# Altium project FDRV_1.2.PrjPCB
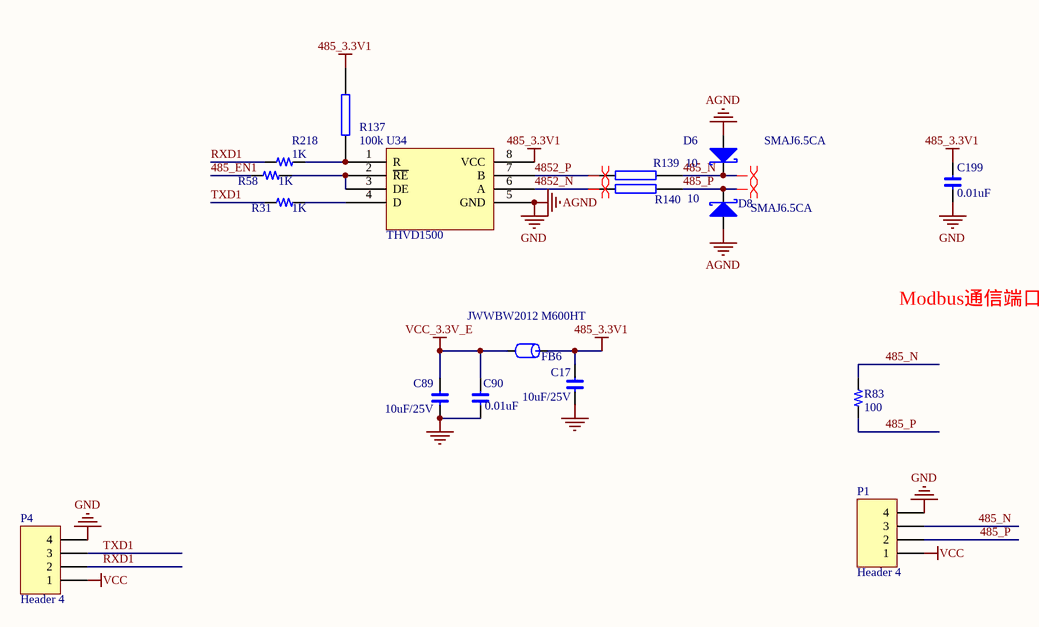
[diagram p0: RS485.SchDoc]
2 sheets, 59 parts. Net scope: global (net labels, ports and power ports of the same name join across sheets).
Board files: PCB1.PcbDoc, 尺子.PcbDoc
Sheets:
  RS485.SchDoc
  Sheet2.SchDoc

## Sheet RS485.SchDoc
size A4

### Parts
C17  10uF/25V  [0603C]
C89  10uF/25V  [0603C]
C90  0.01uF  [0603C]
C199  0.01uF  [0603C]
D6  SMAJ6.5CA  [SMA]
D8  SMAJ6.5CA  [SMA]
FB6  JWWBW2012 M600HT  [0805CZ]
P1  Header 4  [HDR1X4]
P4  Header 4  [HDR1X4]
R31  1K  [0603R]
R58  1K  [0603R]
R83  100  [0603R]
R137  100k  [0603R]
R139  10  [1206R]
R140  10  [1206R]
R218  1K  [0603R]
U34  THVD1500  [so-8]

### Nets
485_3.3V1: C17.2 C199.2 FB6.1 R137.2 U34.8(VCC)
AGND: C17.1 C89.1 C90.1 C199.1 D6.1(A) D8.1(A) P1.4 P4.4 U34.5(GND)  [also labelled GND]
VCC: P1.1 P4.1
VCC_3.3V_E: C89.2 C90.2 FB6.2
485_EN1: R58.2
485_N: D6.2(K) P1.3 R83.2 R139.1
485_P: D8.2(K) P1.2 R83.1 R140.1
4852_N: R140.2 U34.6(A)
4852_P: R139.2 U34.7(B)
RXD1: P4.2 R218.2
TXD1: P4.3 R31.2
NetR31_1: R31.1 U34.4(D)
NetR58_1: R58.1 U34.2(~{RE}) U34.3(DE)
NetR137_1: R137.1 R218.1 U34.1(R)

### Layout directives
differential pair: 485_N, 485_P, 4852_N, 4852_P

### Notes on the sheet
- Modbus通信端口

### Library data of the parts
C17 C89 C90 C199 = C
D6 D8 = DIODE S: Schottky Diode
FB6 = FB: Part Field 1: 磁珠/0603/1K ohm/100MHz; FB: BLM18BD102SN1(muRata); Text Field1: FB
P1 P4 = Header 4: Header, 4-Pin; LatestRevisionDate: 17-Jul-2002; LatestRevisionNote: Re-released for DXP Platform.; Publisher: Altium Limited
R31 R58 R83 R218 = R
R137 R139 R140 = RES2
U34 = SN65HVD06D

## Sheet Sheet2.SchDoc
size A3
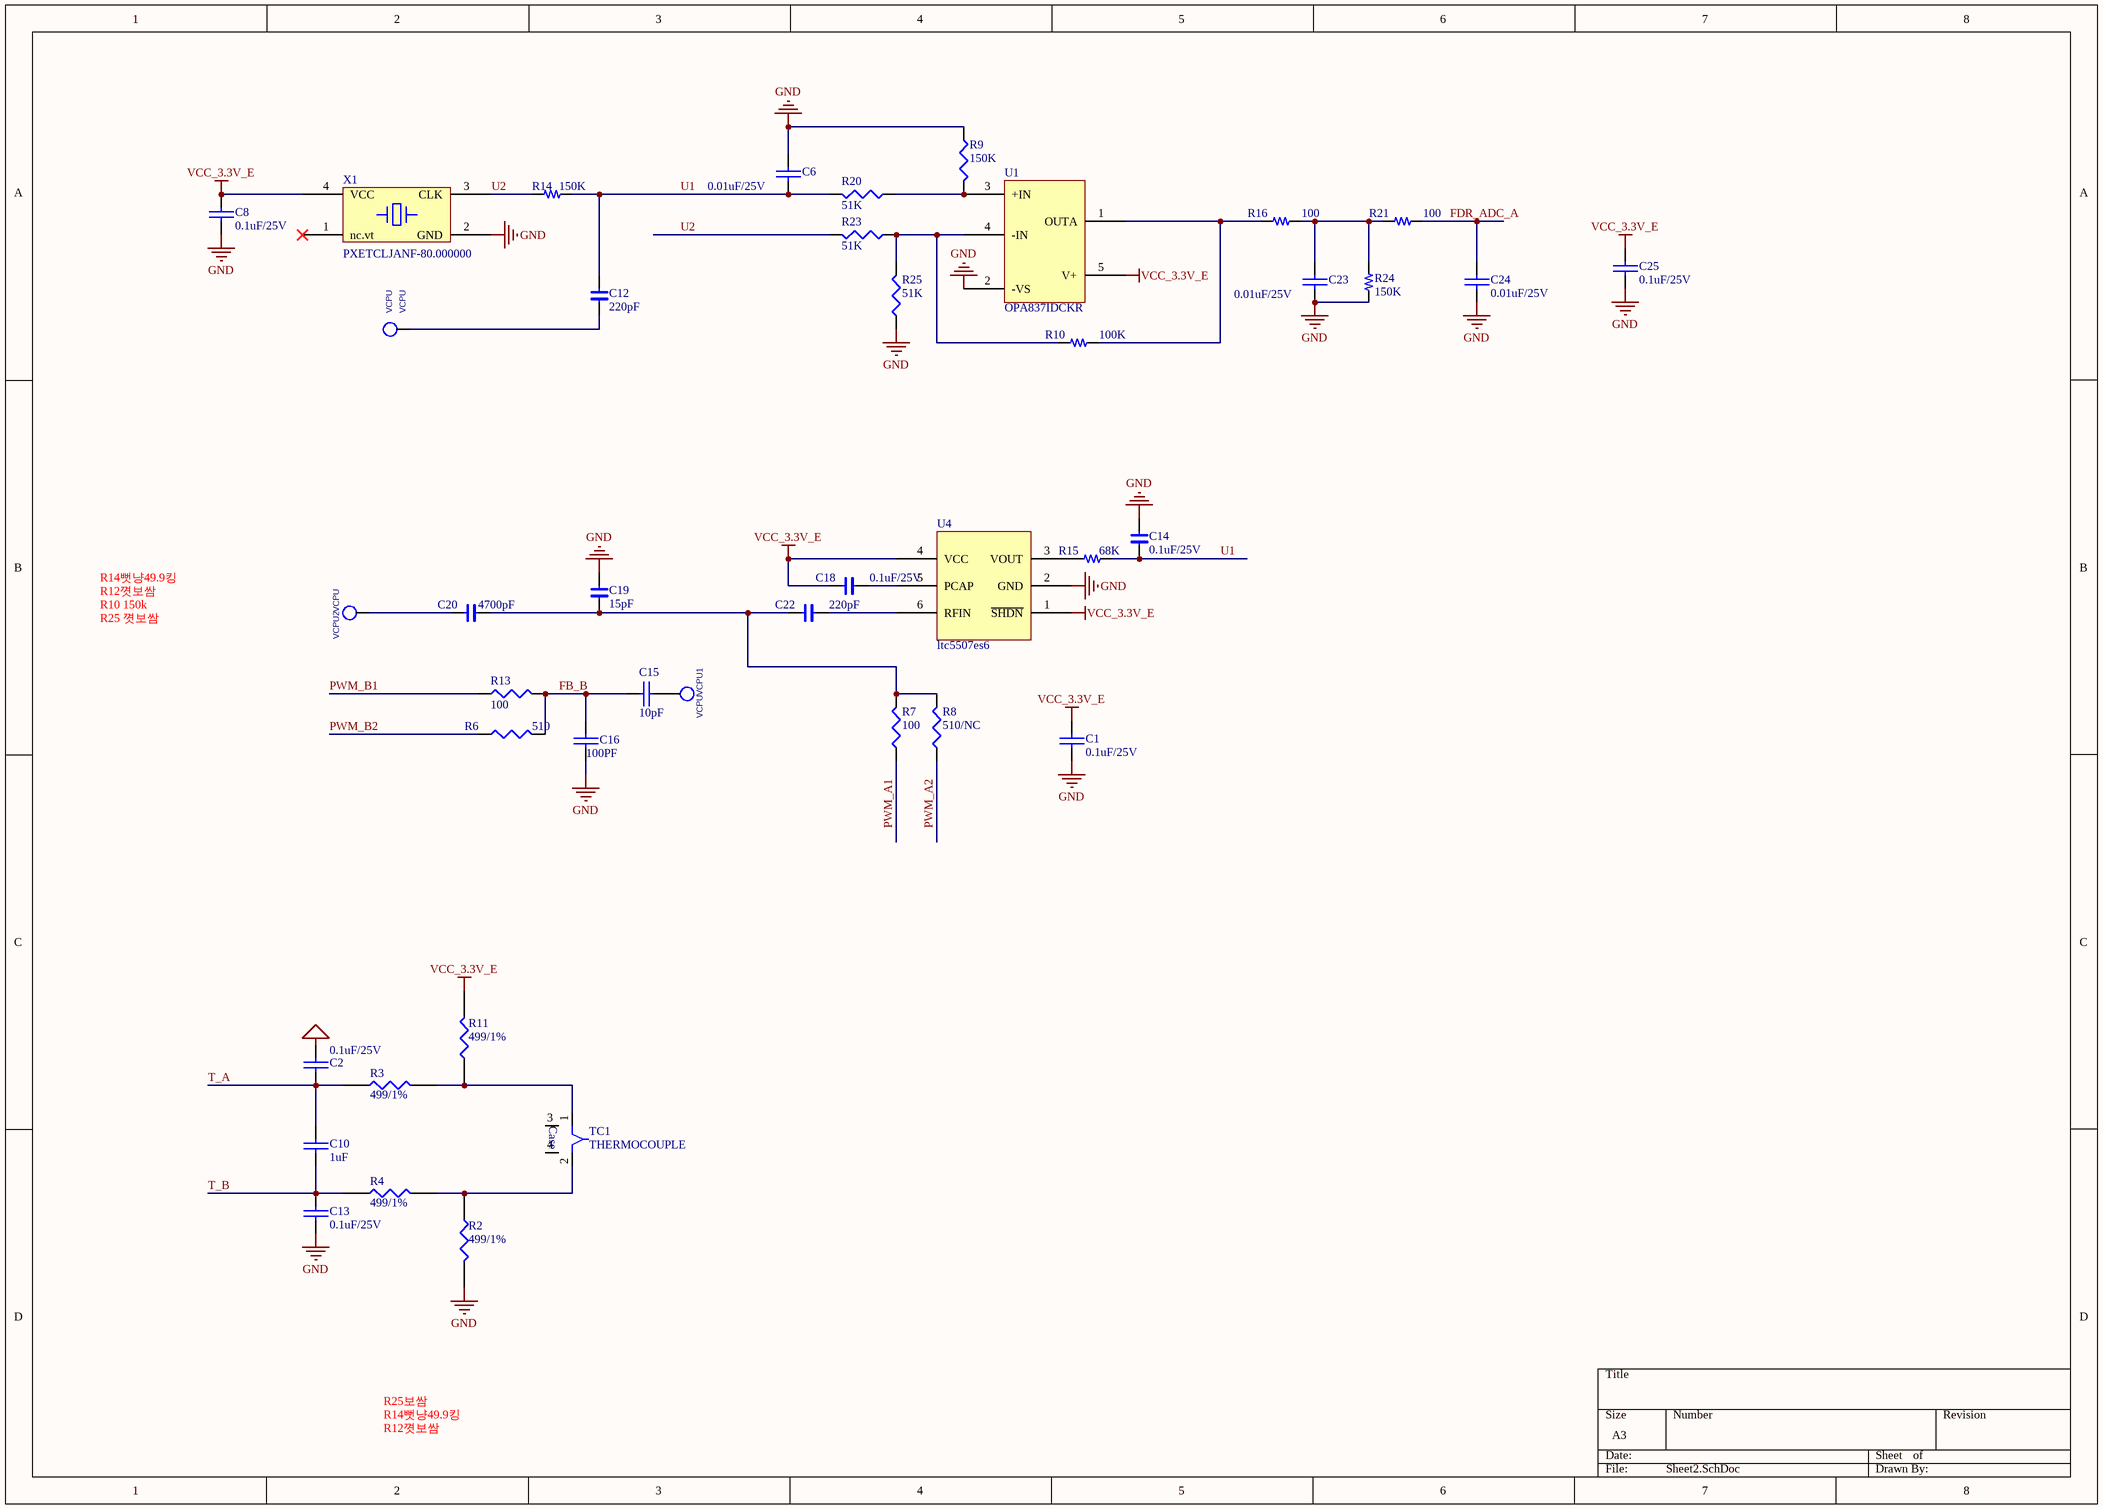
[diagram p1: Sheet2.SchDoc]

### Parts
C1  0.1uF/25V  [0603C]
C2  0.1uF/25V  [0603c]
C6  0.01uF/25V  [0603C]
C8  0.1uF/25V  [0603C]
C10  1uF  [0603c]
C12  220pF  [0603C]
C13  0.1uF/25V  [0603c]
C14  0.1uF/25V  [0603C]
C15  10pF  [0603C]
C16  100PF  [0603C]
C18  0.1uF/25V  [0603C]
C19  15pF  [0603C]
C20  4700pF  [0603C]
C22  220pF  [0603C]
C23  0.01uF/25V  [0603C]
C24  0.01uF/25V  [0603C]
C25  0.1uF/25V  [0603C]
R2  499/1%  [0603r]
R3  499/1%  [0603r]
R4  499/1%  [0603r]
R6  510  [0603R]
R7  100  [0603R]
R8  510/NC  [0603R]
R9  150K  [0603R]
R10  100K  [0603R]
R11  499/1%  [0603r]
R13  100  [0603R]
R14  150K  [0603r]
R15  68K  [0603r]
R16  100  [0603R]
R20  51K  [0603R]
R21  100  [0603R]
R23  51K  [0603R]
R24  150K  [0603R]
R25  51K  [0603R]
TC1  THERMOCOUPLE  [0603R]
U1  OPA837IDCKR  [SC70-5]
U4  ltc5507es6  [SOT23-6]
VCPU  VCPU  [probe]
VCPU1  VCPU  [probe]
VCPU2  VCPU  [probe]
X1  PXETCLJANF-80.000000  [XTAL4TN_7050]

### Nets
GND: C1.1 C2.2 C6.2 C8.2 C13.2 C14.2 C16.2 C19.2 C23.1 C24.1 C25.1 R2.2 R9.1 R24.1 R25.1 U1.2(-VS) U4.2(GND) X1.2(GND)  [project net AGND]
VCC_3.3V_E: C1.2 C8.1 C18.1 C25.2 R11.2 U1.5(V+) U4.1(~{SHDN}) U4.4(VCC) X1.4(VCC)
FB_B: C15.1 C16.1 R6.2 R13.2
FDR_ADC_A: C24.2 R21.2
PWM_A1: R7.1
PWM_A2: R8.1
PWM_B1: R13.1
PWM_B2: R6.1
T_A: C2.1 C10.1 R3.1
T_B: C10.2 C13.1 R4.1
U1: C6.1 C12.2 C14.1 R14.2 R15.1 R20.2
U2: R14.1 R23.2 X1.3(CLK)
NetC12_1: C12.1 VCPU.1(TP)
NetC15_2: C15.2 VCPU1.1(TP)
NetC18_2: C18.2 U4.5(PCAP)
NetC19_1: C19.1 C20.2 C22.1 R7.2 R8.2
NetC20_1: C20.1 VCPU2.1(TP)
NetC22_2: C22.2 U4.6(RFIN)
NetC23_2: C23.2 R16.2 R21.1 R24.2
NetR2_1: R2.1 R4.2 TC1.2
NetR3_2: R3.2 R11.1 TC1.1
NetR9_2: R9.2 R20.1 U1.3(+IN)
NetR10_1: R10.1 R23.1 R25.2 U1.4(-IN)
NetR10_2: R10.2 R16.1 U1.1(OUTA)
NetR15_2: R15.2 U4.3(VOUT)

Not connected (* = marked no-connect by the designer): TC1 3 4; X1 1(nc.vt)*

### Notes on the sheet
- R14뻣냥49.9킹
- R12꼇보쌈
- R10 150k
- R25 꼇보쌈
- R25보쌈
- (in symbol THERMOCOUPLE) Case

### Library data of the parts
C1 C2 C6 C8 C10 C13 C15 C16 C23-C25 = CAP: Capacitor
C12 C14 C18-C20 C22 = C
R2-R4 R11 = RES1
R6-R9 R13 R20 R23 R25 = Res3: Resistor; Published: 8-Jun-2000; LatestRevisionDate: 29-May-2009; LatestRevisionNote: IPC-7351 Footprint Added.; PackageReference: J1-0603; Publisher: Altium Limited; PackageDescription: Chip Resistor
R10 R14-R16 R21 R24 = R
U1 = OPA837 DCK
VCPU VCPU1 VCPU2 = T_POINT_R
X1 = XTAL4S

## Nets that join several sheets
AGND: RS485 (9 pins), Sheet2 (18 pins)
VCC_3.3V_E: RS485 (C89.2 C90.2 FB6.2), Sheet2 (9 pins)